# EasyEDA Pro project DOUBLE_CAMERA_SCARY.eprj, schematic Adafruit OV5640 Breakout
Board Name: Adafruit OV5640 Breakout; Create Date: 2025-06-23; Page Name: Adafruit OV5640 Breakout_1; Project Name: DOUBLE_CAMERA_SCARY; Schematic Name: Adafruit OV5640 Breakout; Update Date: 2025-07-21; Company: EasyEDA.com; Page Size: A4; Version: V1.0
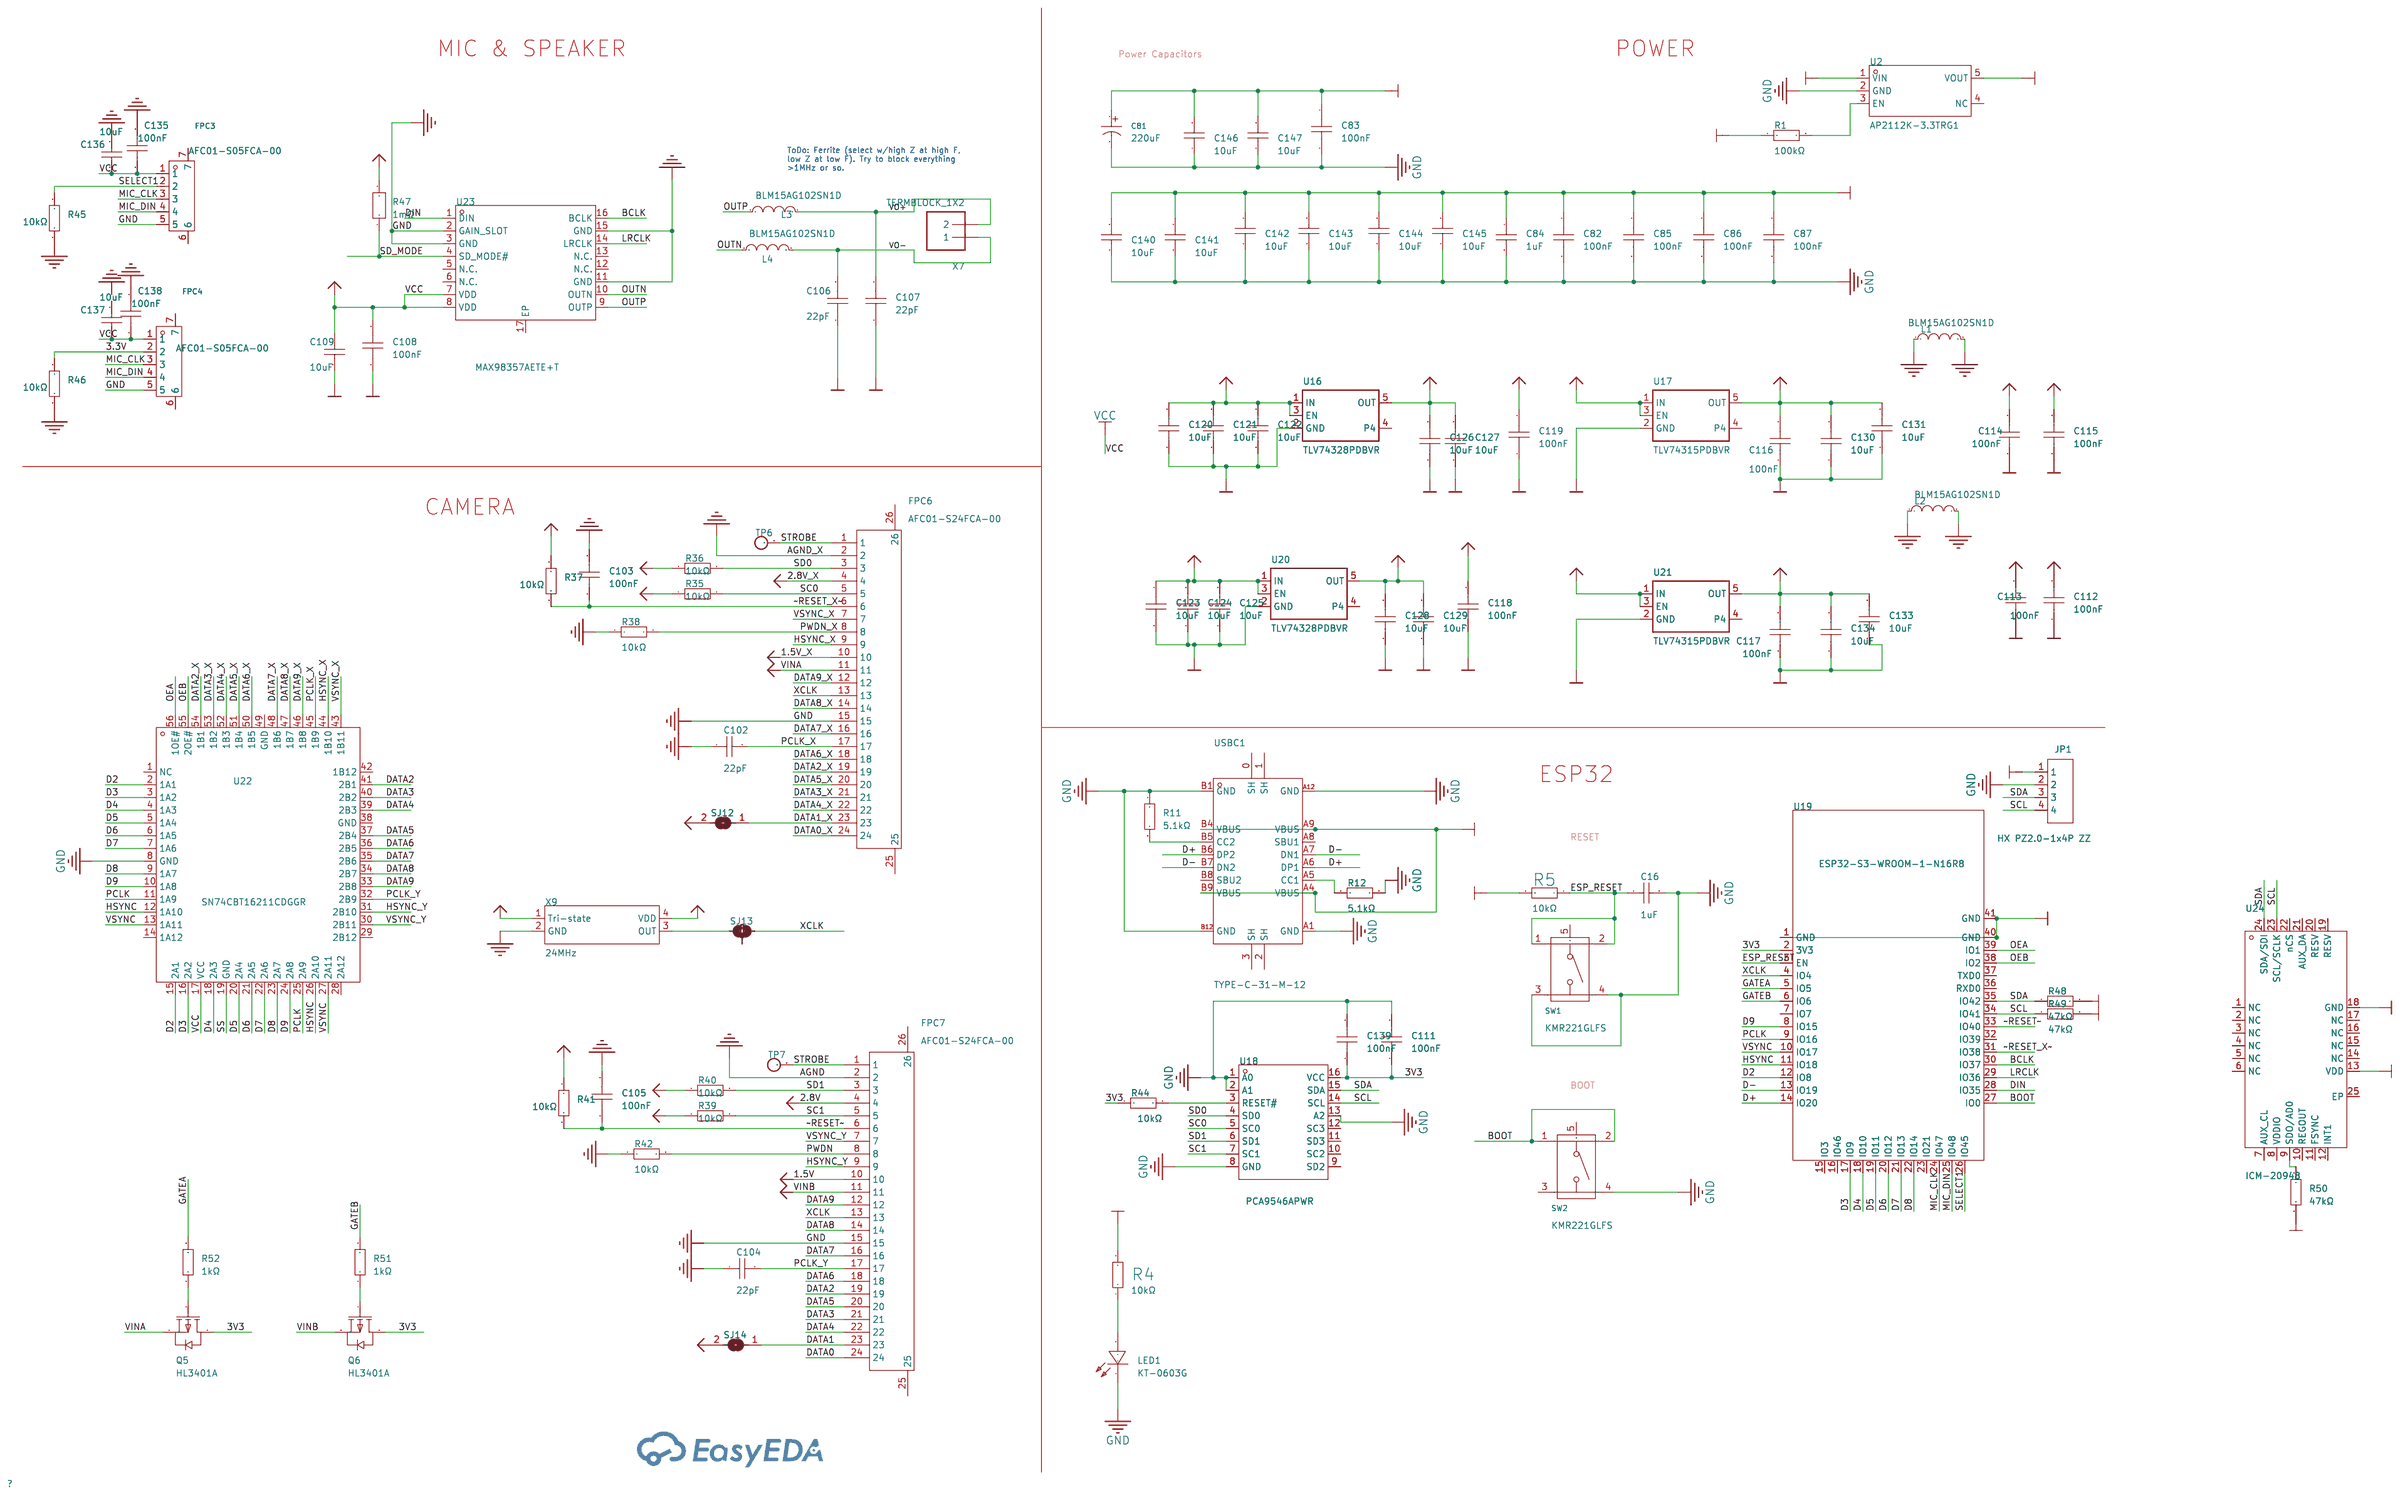
[diagram p0: schematic sheet]

## Parts
C16  1uF  [C0603]
C81  220uF  [CAP-SMD_BD6.3-L6.6-W6.6-LS7.2-FD]
C82  100nF  [C0402]
C83  100nF  [C0402]
C84  1uF  [C0603]
C85  100nF  [C0402]
C86  100nF  [C0402]
C87  100nF  [C0402]
C102  22pF  [C0402]
C103  100nF  [C0402]
C104  22pF  [C0402]
C105  100nF  [C0402]
C106  22pF  [C0402]
C107  22pF  [C0402]
C108  100nF  [C0402]
C109  10uF  [C0402]
C111  100nF  [C0402]
C112  100nF  [C0402]
C113  100nF  [C0402]
C114  100nF  [C0402]
C115  100nF  [C0402]
C116  100nF  [C0402]
C117  100nF  [C0402]
C118  100nF  [C0402]
C119  100nF  [C0402]
C120  10uF  [C0402]
C121  10uF  [C0402]
C122  10uF  [C0402]
C123  10uF  [C0402]
C124  10uF  [C0402]
C125  10uF  [C0402]
C126  10uF  [C0402]
C127  10uF  [C0402]
C128  10uF  [C0402]
C129  10uF  [C0402]
C130  10uF  [C0402]
C131  10uF  [C0402]
C133  10uF  [C0402]
C134  10uF  [C0402]
C135  100nF  [C0402]
C136  10uF  [C0402]
C137  10uF  [C0402]
C138  100nF  [C0402]
C139  100nF  [C0402]
C140  10uF  [C0402]
C141  10uF  [C0402]
C142  10uF  [C0402]
C143  10uF  [C0402]
C144  10uF  [C0402]
C145  10uF  [C0402]
C146  10uF  [C0402]
C147  10uF  [C0402]
FPC3  AFC01-S05FCA-00  [FPC-SMD_AFC01-S05FCA-00]
FPC4  AFC01-S05FCA-00  [FPC-SMD_AFC01-S05FCA-00]
FPC6  AFC01-S24FCA-00  [FPC-SMD_24P-P0.50_AFC01-S24FCA-00]
FPC7  AFC01-S24FCA-00  [FPC-SMD_24P-P0.50_AFC01-S24FCA-00]
JP1  HX PZ2.0-1x4P ZZ  [HDR-TH_4P-P2.00-V-M-3]
L1  BLM15AG102SN1D  [L0402]
L2  BLM15AG102SN1D  [L0402]
L3  BLM15AG102SN1D  [L0402]
L4  BLM15AG102SN1D  [L0402]
LED1  KT-0603G  [LED0603-RD]
Q5  HL3401A  [SOT-23-3_L2.9-W1.3-P1.90-LS2.4-BR]
Q6  HL3401A  [SOT-23-3_L2.9-W1.3-P1.90-LS2.4-BR]
R1  100kΩ  [R0603]
R4  10kΩ  [R0603]
R5  10kΩ  [R0603]
R11  5.1kΩ  [R0603]
R12  5.1kΩ  [R0603]
R35  10kΩ  [R0402]
R36  10kΩ  [R0402]
R37  10kΩ  [R0402]
R38  10kΩ  [R0402]
R39  10kΩ  [R0402]
R40  10kΩ  [R0402]
R41  10kΩ  [R0402]
R42  10kΩ  [R0402]
R44  10kΩ  [R0402]
R45  10kΩ  [R0402]
R46  10kΩ  [R0402]
R47  1mΩ  [R1206]
R48  47kΩ  [R0402]
R49  47kΩ  [R0402]
R50  47kΩ  [R0402]
R51  1kΩ  [R0402]
R52  1kΩ  [R0402]
SJ12  SOLDERJUMPER  [SOLDERJUMPER_ARROW_NOPASTE]
SJ13  SOLDERJUMPER_2WAY  [SOLDERJUMPER_2WAY_OPEN_NOPASTE]
SJ14  SOLDERJUMPER  [SOLDERJUMPER_ARROW_NOPASTE]
SW1  KMR221GLFS  [KEY-SMD_KMR2XXGXXX]
SW2  KMR221GLFS  [KEY-SMD_KMR2XXGXXX]
TP6  TESTPOINTROUND1.5MM  [TESTPOINT_ROUND_1.5MM]
TP7  TESTPOINTROUND1.5MM  [TESTPOINT_ROUND_1.5MM]
U2  AP2112K-3.3TRG1  [SOT-25-5_L2.9-W1.6-P0.95-LS2.8-BL]
U16  TLV74328PDBVR  [SOT-23-5_L3.0-W1.7-P0.95-LS2.8-BL]
U17  TLV74315PDBVR  [SOT-23-5_L2.9-W1.6-P0.95-LS2.8-BL]
U18  PCA9546APWR  [TSSOP-16_L5.0-W4.4-P0.65-LS6.4-BL]
U19  ESP32-S3-WROOM-1-N16R8  [WIRELM-SMD_ESP32-S3-WROOM-1]
U20  TLV74328PDBVR  [SOT-23-5_L3.0-W1.7-P0.95-LS2.8-BL]
U21  TLV74315PDBVR  [SOT-23-5_L2.9-W1.6-P0.95-LS2.8-BL]
U22  SN74CBT16211CDGGR  [TSSOP-56_L14.0-W6.1-P0.50-LS8.1-BL]
U23  MAX98357AETE+T  [TQFN-16_L3.0-W3.0-P0.50-BL-EP1.5]
U24  ICM-20948  [QFN-24_L3.0-W3.0-P0.40-BL-EP]
USBC1  TYPE-C-31-M-12  [USB-C_SMD-TYPE-C-31-M-12]
X7  TERMBLOCK_1X2  [TERMBLOCK_1X2-3.5MM]
X9  24MHz  [OSC-SMD_4P-L3.2-W2.5-BL]

## Library data of the parts
C16 C84 = CL10A105KO8NNNC: Capacitance: Tolerance:±10% Tolerance:±10% Voltage Rated: Temperature Coefficient:; LCSC Part Name: 1uF ±10% 16V; Supplier Part: C1592; Manufacturer: SAMSUNG(三星); Supplier Footprint: 0603; JLCPCB Part Class: Extended Part; Datasheet: https://atta.szlcsc.com/upload/public/pdf/source/20220919/9FBE606BE0D9532D730F292EB26DC5BB.pdf; Supplier: LCSC; Tolerance: ±10%
C81 = RVT0J221M0605: Capacitance: Tolerance:±20% Tolerance:±20% Rated Voltage: Ripple Current:- Equivalent Series Resistance(ESR):- φD: L: Lifetime @ Temp:2000hrs@105℃ Operating Temperature:-55℃~+105℃ Operating Temperature:-55℃~+105℃; LCSC Part Name: 220uF ±20% 6.3V; Supplier Part: C32514; Manufacturer: HONOR(荣誉); Supplier Footprint: SMD,D6.3xL5.4mm; JLCPCB Part Class: Extended Part; Datasheet: https://atta.szlcsc.com/upload/public/pdf/source/20210521/C113284_25C86AE95FB541053FE695F13EA8E7D0.pdf; Supplier: LCSC; Tolerance: ±20%; Lifetime @ Temp: 2000hrs@105℃; Operating Temperature: -55℃~+105℃
C82 C83 C85-C87 = CL05B104KO5NNNC: Capacitance: Tolerance:±10% Tolerance:±10% Voltage Rated: Temperature Coefficient:; LCSC Part Name: 100nF ±10% 16V; Supplier Part: C1525; Manufacturer: SAMSUNG(三星); Supplier Footprint: 0402; JLCPCB Part Class: Basic Part; Datasheet: https://atta.szlcsc.com/upload/public/pdf/source/20160218/1457707763339.pdf; Supplier: LCSC; Tolerance: ±10%
C102 C104 = 0402CG220J500NT: LCSC Part Name: 22pF ±5% 50V; Supplier Part: C1555; Manufacturer: FH(风华); Supplier Footprint: 0402; JLCPCB Part Class: 基础库; Datasheet: https://atta.szlcsc.com/upload/public/pdf/source/20200305/C486355_26A10D38EF8C2A5C37091D0039909270.pdf; Supplier: LCSC; Tolerance: ±5%; Voltage Rated: 50V; Temperature Coefficient: C0G
C103 C105 C108 C111-C119 C135 C138 C139 = CL05B104KB54PNC: LCSC Part Name: 100nF ±10% 50V; Supplier Part: C307331; Manufacturer: SAMSUNG(三星); Supplier Footprint: 0402; JLCPCB Part Class: 基础库; Datasheet: https://atta.szlcsc.com/upload/public/pdf/source/20160218/1457707763339.pdf; Supplier: LCSC; Tolerance: ±10%; Voltage Rated: 50V; Temperature Coefficient: X7R
C106 C107 = CGA0402C0G220J500GT: LCSC Part Name: 22pF ±5% 50V; Supplier Part: C42371856; Manufacturer: HRE(芯声); Supplier Footprint: 0402; JLCPCB Part Class: 扩展库; Datasheet: https://atta.szlcsc.com/upload/public/pdf/source/20241029/0FA3B23816F5927C93C31CDBE8F5BD84.pdf; Supplier: LCSC; Tolerance: ±5%; Voltage Rating: 50V; Temperature Coefficient: C0G
C109 C136 C137 C140-C147 = CL05A106MQ5NUNC: LCSC Part Name: 10uF ±20% 6.3V; Supplier Part: C15525; Manufacturer: SAMSUNG(三星); Supplier Footprint: 0402; JLCPCB Part Class: 基础库; Datasheet: https://atta.szlcsc.com/upload/public/pdf/source/20220823/2B02EE04F8F211D38A52DCB16EB6BEBA.pdf; Supplier: LCSC; Tolerance: ±20%; Voltage Rated: 6.3V; Temperature Coefficient: X5R
C120-C131 C133 C134 = HGC0402R5106M100NTEJ: LCSC Part Name: 10uF ±20% 10V; Supplier Part: C7472949; Manufacturer: Chinocera(华瓷); Supplier Footprint: 0402; JLCPCB Part Class: 扩展库; Datasheet: https://atta.szlcsc.com/upload/public/pdf/source/20240320/FAC3FEC40A78BC5CCCE96C232A94D860.pdf; Supplier: LCSC; Tolerance: ±20%; Voltage Rated: 10V; Temperature Coefficient: X5R
FPC3 FPC4 = AFC01-S05FCA-00: Locking Feature:Clamshell Contact Type:Bottom Contact Number of Contacts:5P Pitch:0.5mm Mounting Type:卧贴 FFC, FCB Thickness:0.3mm FFC, FCB Thickness:0.3mm Height Above Board:2mm; LCSC Part Name: 间距:0.5mm P数:5P 翻盖式 下接; Supplier Part: C262654; Manufacturer: JS(钜硕电子); Supplier Footprint: SMD,P=0.5mm,卧贴; JLCPCB Part Class: Extended Part; Datasheet: https://atta.szlcsc.com/upload/public/pdf/source/20190816/C413942_2A72D1AC756EAE17EEDF756A339D4500.pdf; Supplier: LCSC; Locking Feature: Clamshell; Contact Type: Bottom Contact; Number of Contacts: 5P; Pitch: 0.5mm; Mounting Type: 卧贴; FFC, FCB Thickness: 0.3mm; Height Above Board: 2mm
FPC6 FPC7 = AFC01-S24FCA-00: LCSC Part Name: 间距:0.5mm P数:24P 翻盖式 下接; Supplier Part: C262669; Manufacturer: JS(钜硕电子); Supplier Footprint: SMD,P=0.5mm,卧贴; JLCPCB Part Class: 扩展库; Datasheet: https://atta.szlcsc.com/upload/public/pdf/source/20190816/C413942_2A72D1AC756EAE17EEDF756A339D4500.pdf; Supplier: LCSC; Locking Feature: 翻盖式; Contact Type: 下接; Number of Contacts: 24P; Pitch: 0.5mm; Mounting Type: 卧贴; FFC, FCB Thickness: 0.3mm; Height Above Board: 2mm
JP1 = HX PZ2.0-1x4P ZZ: LCSC Part Name: 1x4P 间距:2mm 方针 直插; Supplier Part: C22438287; Manufacturer: hanxia(韩下); Supplier Footprint: 插件,P=2mm; JLCPCB Part Class: Extended Part; Datasheet: https://atta.szlcsc.com/upload/public/pdf/source/20240522/4041CF8381B23872C6D86DE397775C63.pdf; Supplier: LCSC; Pin Structure: 1x4P; Pitch: 2mm; Circluar Pins/Square Pins: Policy; Mounting Type: Straight; Number of Rows: Single Row; Number of Pins: 4P; Current Rating: 1.5A; Length of Mating Pin: 3.9mm; Insulation Height: 2mm; Length of End Connection Pin: 2.8mm; Contact Material: Phosphor Bronze; Contact Plating: Gold; Operating Temperature: -40℃~+105℃; Color: Black
L1-L4 = BLM15AG102SN1D: LCSC Part Name: 单路 0402磁珠 阻抗1kΩ@100MHz; Supplier Part: C76883; Manufacturer: muRata(村田); Supplier Footprint: 0402; JLCPCB Part Class: 扩展库; Datasheet: https://atta.szlcsc.com/upload/public/pdf/source/20181120/C333978_3E581FB55966932B05020139ABDE8E01.pdf; Supplier: LCSC; Impedance @ Frequency: 1kΩ@100MHz; Tolerance: ±25%; DC Resistance: 650mΩ; Current Rating: 300mA; Circuits: 1
LED1 = KT-0603G: Emitted Color:Emerald; LCSC Part Name: 0603 翠绿 高亮; Supplier Part: C12624; Manufacturer: KENTO; Supplier Footprint: 0603; JLCPCB Part Class: Extended Part; Datasheet: https://atta.szlcsc.com/upload/public/pdf/source/20160120/1457707754255.pdf; Supplier: LCSC; Emitted Color: Emerald
Q5 Q6 = HL3401A: LCSC Part Name: 1个P沟道 耐压:30V 电流:4.2A; Supplier Part: C7420349; Manufacturer: 宏嘉诚; Supplier Footprint: SOT-23; JLCPCB Part Class: 扩展库; Datasheet: https://atta.szlcsc.com/upload/public/pdf/source/20250218/AB44DCFCE1A4DB9A9C9188D881903A3E.pdf; Supplier: LCSC; Type: 1个P沟道; Drain to Source Voltage: 30V; Current - Continuous Drain(Id): 4.2A; RDS(on): 55mΩ@10V,4.2A; Pd - Power Dissipation: 350mW; Gate Threshold Voltage (Vgs(th)@Id): 900mV; Gate Charge(Qg): 22nC@10V; Input Capacitance(Ciss@Vds): 954pF; Reverse Transfer Capacitance (Crss@Vds): 77pF; Operating Temperature: -55℃~+150℃
R1 = 0603WAF1003T5E: Type:Thick Film Resistors Resistance:100kΩ Tolerance:±1% Tolerance:±1% Power(Watts): Overload Voltage (Max): Temperature Coefficient:±100ppm/℃ Temperature Coefficient:±100ppm/℃ Operating Temperature Range:-55℃~+155℃ Operating Temperature Range:-55℃~+155℃; LCSC Part Name: 100kΩ ±1% 100mW 厚膜电阻; Supplier Part: C25803; Manufacturer: UNI-ROYAL(厚声); Supplier Footprint: 0603; Datasheet: https://atta.szlcsc.com/upload/public/pdf/source/20200306/C422600_1E6D84923E4A46A82E41ADD87F860B5C.pdf; Supplier: LCSC; Type: Thick Film Resistors; Tolerance: ±1%; Temperature Coefficient: ±100ppm/℃; Operating Temperature Range: -55℃~+155℃
R4 R5 = 0603WAF1002T5E: Type:Thick Film Resistors Resistance:10kΩ Tolerance:±1% Tolerance:±1% Power(Watts): Overload Voltage (Max): Temperature Coefficient:±100ppm/℃ Temperature Coefficient:±100ppm/℃ Operating Temperature Range:-55℃~+155℃ Operating Temperature Range:-55℃~+155℃; LCSC Part Name: 厚膜电阻 10kΩ ±1% 100mW; Supplier Part: C25804; Manufacturer: UNI-ROYAL(厚声); Supplier Footprint: 0603; Datasheet: https://atta.szlcsc.com/upload/public/pdf/source/20200306/C422600_1E6D84923E4A46A82E41ADD87F860B5C.pdf; Supplier: LCSC; Type: Thick Film Resistors; Tolerance: ±1%; Temperature Coefficient: ±100ppm/℃; Operating Temperature Range: -55℃~+155℃
R11 R12 = 0603WAF5101T5E: Type:Thick Film Resistors Resistance:5.1kΩ Tolerance:±1% Tolerance:±1% Power(Watts): Overload Voltage (Max): Temperature Coefficient:±100ppm/℃ Temperature Coefficient:±100ppm/℃ Operating Temperature Range:-55℃~+155℃ Operating Temperature Range:-55℃~+155℃; LCSC Part Name: 5.1kΩ ±1% 100mW 厚膜电阻; Supplier Part: C23186; Manufacturer: UNI-ROYAL(厚声); Supplier Footprint: 0603; Datasheet: https://atta.szlcsc.com/upload/public/pdf/source/20200306/C422600_1E6D84923E4A46A82E41ADD87F860B5C.pdf; Supplier: LCSC; Type: Thick Film Resistors; Tolerance: ±1%; Temperature Coefficient: ±100ppm/℃; Operating Temperature Range: -55℃~+155℃
R35-R42 R44-R46 = 0402WGF1002TCE: LCSC Part Name: 10kΩ ±1% 62.5mW 厚膜电阻; Supplier Part: C25744; Manufacturer: UNI-ROYAL(厚声); Supplier Footprint: 0402; JLCPCB Part Class: 基础库; Datasheet: https://atta.szlcsc.com/upload/public/pdf/source/20200306/C422600_1E6D84923E4A46A82E41ADD87F860B5C.pdf; Supplier: LCSC; Type: 厚膜电阻; Tolerance: ±1%; Power(Watts): 62.5mW; Overload Voltage (Max): 50V; Temperature Coefficient: ±100ppm/℃; Operating Temperature Range: -55℃~+155℃
R47 = RE1206F1R001: LCSC Part Name: 1mΩ 1W 1206 ±1%; Supplier Part: C46961738; Manufacturer: 捷而瑞; Supplier Footprint: 1206; JLCPCB Part Class: 扩展库; Datasheet: https://atta.szlcsc.com/upload/public/pdf/source/20250325/401775B85EF7B3A580BC34DFED100CB2.pdf; Supplier: LCSC; Type: 采样电阻; Tolerance: ±1%; Power(Watts): 1W; Temperature Coefficient: ±100ppm/℃
R48-R50 = 0402WGF4702TCE: LCSC Part Name: 47kΩ ±1% 62.5mW 厚膜电阻; Supplier Part: C25792; Manufacturer: UNI-ROYAL(厚声); Supplier Footprint: 0402; JLCPCB Part Class: 基础库; Datasheet: https://atta.szlcsc.com/upload/public/pdf/source/20200306/C422600_1E6D84923E4A46A82E41ADD87F860B5C.pdf; Supplier: LCSC; Type: 厚膜电阻; Tolerance: ±1%; Power(Watts): 62.5mW; Overload Voltage (Max): 50V; Temperature Coefficient: ±100ppm/℃; Operating Temperature Range: -55℃~+155℃
R51 R52 = 0402WGF1001TCE: LCSC Part Name: 1kΩ ±1% 62.5mW 厚膜电阻; Supplier Part: C11702; Manufacturer: UNI-ROYAL(厚声); Supplier Footprint: 0402; JLCPCB Part Class: 基础库; Datasheet: https://atta.szlcsc.com/upload/public/pdf/source/20200306/C422600_1E6D84923E4A46A82E41ADD87F860B5C.pdf; Supplier: LCSC; Type: 厚膜电阻; Tolerance: ±1%; Power(Watts): 62.5mW; Overload Voltage (Max): 50V; Temperature Coefficient: ±100ppm/℃; Operating Temperature Range: -55℃~+155℃
SJ12 SJ14 = microbuilder_SOLDERJUMPER_: BOM: EXCLUDE
SJ13 = microbuilder_SOLDERJUMPER_2WAY_
SW1 SW2 = KMR221GLFS: Circuit:SPST Actuator Style:Round Button Operating Force:200gf Mounting Style:Brick nogging Switch Length:4.6mm Switch Width:2.8mm Switch Height:1.9mm Contact Current:50mA Voltage Rating (DC):32V With Lamp:- Pin Style:Gull Wing Mechanical Life:- Operating; LCSC Part Name: 4.6*2.8*1.9mm 立贴 轻触开关; Supplier Part: C72443; Manufacturer: C&K; Supplier Footprint: SMD; JLCPCB Part Class: Extended Part; Datasheet: https://atta.szlcsc.com/upload/public/pdf/source/20181012/C265019_000848423B8E84768868498C37CC451B.pdf; Supplier: LCSC; Circuit: SPST; Actuator Style: Round Button; Operating Force: 200gf; Mounting Style: Brick nogging; Switch Length: 4.6mm; Switch Width: 2.8mm; Switch Height: 1.9mm; Contact Current: 50mA; Voltage Rating (DC): 32V; Pin Style: Gull Wing; Operating Temperature: -40℃~+85℃
TP6 TP7 = microbuilder_TESTPOINT_ROUND1.5MM
U2 = AP2112K-3.3TRG1: Output Type:Fixed Maximum Input Voltage:6V Output Voltage:3.3V Output Voltage:3.3V Output Current:600mA Power Supply Rejection Ratio (PSRR):65dB@(1kHz) Dropout Voltage:400mV@(600mA) standby current:80uA Feature:ESD Protection；Automatic Discharge Function；; LCSC Part Name: 输入6V 输出3.3V 600mA; Supplier Part: C51118; Manufacturer: DIODES(美台); Supplier Footprint: SOT-25-5; JLCPCB Part Class: Extended Part; Datasheet: https://atta.szlcsc.com/upload/public/pdf/source/20171221/C51118_15138312998391195590.pdf; Supplier: LCSC; Output Type: Fixed; Maximum Input Voltage: 6V; Output Voltage: 3.3V; Output Current: 600mA; Power Supply Rejection Ratio (PSRR): 65dB@(1kHz); Dropout Voltage: 400mV@(600mA); standby current: 80uA; Feature: ESD Protection；Automatic Discharge Function；Low ESR；Thermal Protection(TSD)；Overcurrent Protection(OCP)；With ability; Operating Temperature: -40℃~+85℃; Output Polarity: Positive electrode; Number of Outputs: 1
U16 U20 = TLV74328PDBVR: LCSC Part Name: 具有使能功能的 300mA、低 IQ、低压降稳压器; Supplier Part: C408971; Manufacturer: TI(德州仪器); Supplier Footprint: SOT-23-5; JLCPCB Part Class: Extended Part; Datasheet: https://www.ti.com/cn/lit/gpn/tlv743p; Supplier: LCSC; Output Type: Fixed; Maximum Input Voltage: 5.5V; Output Voltage: 2.8V; Output Current: 300mA; Power Supply Rejection Ratio (PSRR): 68dB; Dropout Voltage: 290mV@(300mA); standby current: 60uA; Feature: 防静电保护；低ESR；Thermal Protection(TSD)；欠压闭锁；Overcurrent Protection(OCP)；带使能; Operating Temperature: -40℃~+125℃@(Tj); Output Polarity: Positive electrode; Number of Outputs: 1
U17 U21 = TLV74315PDBVR: LCSC Part Name: 具有使能功能的 300mA、低 IQ、低压降稳压器; Supplier Part: C469895; Manufacturer: TI(德州仪器); Supplier Footprint: SOT-23-5; JLCPCB Part Class: Extended Part; Datasheet: https://www.ti.com/cn/lit/gpn/tlv743p; Supplier: LCSC; Output Type: Fixed; Maximum Input Voltage: 5.5V; Output Voltage: 1.5V; Output Current: 300mA; Dropout Voltage: 400mV@(300mA); standby current: 60uA; Feature: ESD Protection；Short-Circuit  Protection；Low ESR；Thermal Protection(TSD)；Under-voltage Lockout；Overcurrent Protection(OCP)；With ability; Operating Temperature: -40℃~+125℃@(Tj); Output Polarity: Positive electrode; Number of Outputs: 1
U18 = PCA9546APWR: Interface:I2C；SMBus Voltage - Supply:2.3V~5.5V Voltage - Supply:2.3V~5.5V Operating Temperature:-40℃~+85℃ Operating Temperature:-40℃~+85℃; LCSC Part Name: PCA9546A低电压4通道I²C和SMBus开关带复位功能; Supplier Part: C400705; Manufacturer: TI(德州仪器); Supplier Footprint: TSSOP-16; JLCPCB Part Class: Extended Part; Datasheet: https://www.ti.com/cn/lit/gpn/pca9546a; Supplier: LCSC; Interface: I2C；SMBus; Voltage - Supply: 2.3V~5.5V; Operating Temperature: -40℃~+85℃
U19 = ESP32-S3-WROOM-1-N16R8: LCSC Part Name: 通用型Wi-Fi+低功耗蓝牙MCU模组; Supplier Part: C2913202; Manufacturer: ESPRESSIF(乐鑫); Supplier Footprint: SMD,18x25.5mm; JLCPCB Part Class: Extended Part; Datasheet: https://atta.szlcsc.com/upload/public/pdf/source/20241030/6A412B13087E1327DF6279F5735253CA.pdf; Supplier: LCSC
U22 = SN74CBT16211CDGGR: Supplier Part: C2674756; Manufacturer: TI(德州仪器); Supplier Footprint: TSSOP-56-6.1mm; JLCPCB Part Class: Extended Part; Datasheet: https://www.ti.com/cn/lit/gpn/sn74cbt16211c; Supplier: LCSC
U23 = MAX98357AETE+T: LCSC Part Name: 微型、低成本、PCM 类 D 级放大器具有 AB 级性能; Supplier Part: C910544; Manufacturer: ADI(亚德诺)/MAXIM(美信); Supplier Footprint: TQFN-16-EP(3x3); JLCPCB Part Class: 扩展库; Datasheet: https://atta.szlcsc.com/upload/public/pdf/source/20210106/C910544_CB6DE4B2CEE254A72E6BDB40E718D281.pdf; Supplier: LCSC; Voltage - Supply: 2.5V~5.5V; Operating Temperature: -40℃~+85℃
U24 = ICM-20948: Supplier Part: C726001; Manufacturer: TDK InvenSense(应美盛); Supplier Footprint: QFN-24(3x3); JLCPCB Part Class: 扩展库; Datasheet: https://atta.szlcsc.com/upload/public/pdf/source/20210715/C726001_EFE09342631EBC06FA98BEAE6CEEEE9D.pdf; Supplier: LCSC; Sensor Type: 加速度计陀螺仪; Operating Temperature: -40℃~+85℃
USBC1 = TYPE-C-31-M-12: Connector Type:Type-C Standard:- Gender:Female Mounting Style:- Number of Contacts:16P Number of Ports:1 Current Rating - Power (Max):5A Operating Temperature Range:- Operating Temperature Range:-; LCSC Part Name: Type-C 母; Supplier Part: C165948; Manufacturer: 韩国韩荣; Supplier Footprint: SMD; Datasheet: https://atta.szlcsc.com/upload/public/pdf/source/20220525/466408E853115E789EDB0DDC29077C05.pdf; Supplier: LCSC; Connector Type: Type-C; Gender: Female; Number of Contacts: 16P; Number of Ports: 1; Current Rating - Power (Max): 5A
X7 = microbuilder_TERMBLOCK_1X2_
X9 = OT2EL4C4JI-111OLP-24M: LCSC Part Name: YSO110TR 24MHZ 4P 3225 1.8V-3.3V ±10PPM -40~85℃ (±20PPM) CMOS; Supplier Part: C5203548; Manufacturer: YXC(扬兴晶振); Supplier Footprint: SMD3225-4P; JLCPCB Part Class: 扩展库; Datasheet: https://atta.szlcsc.com/upload/public/pdf/source/20240731/596E5F7673E50DA744B7F79F139FB8DF.pdf; Supplier: LCSC; Normal temperature Frequency Tolerance: ±10ppm; Output Type: CMOS; Voltage - Supply: 1.8V~3.3V; Frequency Stability: ±20ppm; Operating Temperature: -40℃~+85℃

## Nets
1.5V: C113.2 C117.2 C133.2 C134.2 FPC7.10 U21.5(OUT)
1.5V_X: C114.2 C116.2 C130.2 C131.2 FPC6.10 U17.5(OUT)
2.8V: C112.2 C128.2 C129.2 FPC7.4 U20.5(OUT)
2.8V_X: C115.2 C126.2 C127.2 FPC6.4 U16.5(OUT)
3.3V: FPC4.2 R46.1
3V3: C82.1 C84.1 C85.1 C86.1 C87.1 C111.1 C118.2 C119.2 C139.1 C140.2 C141.2 C142.2 C143.2 C144.2 C145.2 Q5.3(D) Q6.3(D) R4.2 R5.2 R44.1 R48.2 R49.2 R50.2 SJ12.2 SJ14.2 U2.5(VOUT) U18.16(VCC) U19.2(3V3) U24.13(VDD) X9.1(Tri-state) X9.4(VDD)
AGND: FPC7.2 L2.2
AGND_X: FPC6.2 L1.2
GND: C16.2 C81.2 C82.2 C83.2 C84.2 C85.2 C86.2 C87.2 C102.1 C103.2 C104.1 C105.2 C106.1 C107.1 C108.1 C109.1 C111.2 C112.1 C113.1 C114.1 C115.1 C116.1 C117.1 C118.1 C119.1 C120.1 C121.1 C122.1 C123.2 C124.1 C125.1 C126.1 C127.1 C128.1 C129.1 C130.1 C131.1 C133.1 C134.1 C135.2 C136.2 C138.2 C139.2 C140.1 C141.1 C142.1 C143.1 C144.1 C145.1 C146.1 C147.1 FPC3.5 FPC4.5 FPC6.15 FPC7.15 JP1.2 L1.1 L2.1 LED1.1(K) R11.1 R12.2 R38.1 R42.1 R45.2 R46.2 SW1.3 SW1.4 SW2.4 U2.2(GND) U16.2(GND) U17.2(GND) U18.1(A0) U18.2(A1) U18.8(GND) U18.13(A2) U19.1(GND) U19.40(GND) U19.41(GND) U20.2(GND) U21.2(GND) U22.8(GND) U23.2(GAIN_SLOT) U23.3(GND) U23.11(GND) U23.15(GND) U24.18(GND) USBC1.A1(GND) USBC1.A12(GND) USBC1.B1(GND) USBC1.B12(GND) X9.2(GND)
VCC: C81.1 C83.1 C108.2 C109.2 C135.1 C136.1 C137.1 C138.1 C146.2 C147.2 FPC3.1 FPC4.1 JP1.1 R1.1 R47.2 U2.1(VIN) U22.17(VCC) U23.7(VDD) U23.8(VDD) USBC1.A4(VBUS) USBC1.A9(VBUS) USBC1.B4(VBUS) USBC1.B9(VBUS)
VINA: C120.2 C121.2 C122.2 FPC6.11 Q5.2(S) R35.1 R36.1 R37.1 U16.1(IN) U16.3(EN) U17.1(IN) U17.3(EN)
VINB: C123.1 C124.2 C125.2 FPC7.11 Q6.2(S) R39.1 R40.1 R41.1 U20.1(IN) U20.3(EN) U21.1(IN) U21.3(EN)
BCLK: U19.30(IO37) U23.16(BCLK)
BOOT: SW2.1 SW2.2 U19.27(IO0)
D2: U19.12(IO8) U22.2(1A1) U22.15(2A1)
D3: U19.17(IO9) U22.3(1A2) U22.16(2A2)
D4: U19.18(IO10) U22.4(1A3) U22.18(2A3)
D5: U19.19(IO11) U22.5(1A4) U22.20(2A4)
D6: U19.20(IO12) U22.6(1A5) U22.21(2A5)
D7: U19.21(IO13) U22.7(1A6) U22.22(2A6)
D8: U19.22(IO14) U22.9(1A7) U22.23(2A7)
D9: U19.8(IO15) U22.10(1A8) U22.24(2A8)
D+: U19.14(IO20) USBC1.A6(DP1) USBC1.B6(DP2)
D-: U19.13(IO19) USBC1.A7(DN1) USBC1.B7(DN2)
DATA0: FPC7.24
DATA0_X: FPC6.24
DATA1: FPC7.23 SJ14.1
DATA1_X: FPC6.23 SJ12.1
DATA2: FPC7.19 U22.41(2B1)
DATA2_X: FPC6.19 U22.54(1B1)
DATA3: FPC7.21 U22.40(2B2)
DATA3_X: FPC6.21 U22.53(1B2)
DATA4: FPC7.22 U22.39(2B3)
DATA4_X: FPC6.22 U22.52(1B3)
DATA5: FPC7.20 U22.37(2B4)
DATA5_X: FPC6.20 U22.51(1B4)
DATA6: FPC7.18 U22.36(2B5)
DATA6_X: FPC6.18 U22.50(1B5)
DATA7: FPC7.16 U22.35(2B6)
DATA7_X: FPC6.16 U22.48(1B6)
DATA8: FPC7.14 U22.34(2B7)
DATA8_X: FPC6.14 U22.47(1B7)
DATA9: FPC7.12 U22.33(2B8)
DATA9_X: FPC6.12 U22.46(1B8)
DIN: U19.28(IO35) U23.1(DIN)
ESP_RESET: C16.1 R5.1 SW1.1 SW1.2 U19.3(EN)
GATEA: R52.2 U19.5(IO5)
GATEB: R51.2 U19.6(IO6)
HSYNC: U19.11(IO18) U22.12(1A10) U22.26(2A10)
HSYNC_X: FPC6.9 U22.44(1B10)
HSYNC_Y: FPC7.9 U22.31(2B10)
LRCLK: U19.29(IO36) U23.14(LRCLK)
MIC_CLK: FPC3.3 FPC4.3 U19.24(IO47)
MIC_DIN: FPC3.4 FPC4.4 U19.25(IO48)
OEA: U19.39(IO1) U22.56(1OE#)
OEB: U19.38(IO2) U22.55(2OE#)
OUTN: L4.1 U23.10(OUTN)
OUTP: L3.1 U23.9(OUTP)
PCLK: U19.9(IO16) U22.11(1A9) U22.25(2A9)
PCLK_X: C102.2 FPC6.17 U22.45(1B9)
PCLK_Y: C104.2 FPC7.17 U22.32(2B9)
PWDN: FPC7.8 R42.2
PWDN_X: FPC6.8 R38.2
SC0: FPC6.5 R35.2 U18.5(SC0)
SC1: FPC7.5 R39.2 U18.7(SC1)
SCL: JP1.4 R49.1 U18.14(SCL) U19.34(IO41) U24.23(SCL/SCLK)
SD0: FPC6.3 R36.2 U18.4(SD0)
SD1: FPC7.3 R40.2 U18.6(SD1)
SD_MODE: R47.1 U23.4(SD_MODE#)
SDA: JP1.3 R48.1 U18.15(SDA) U19.35(IO42) U24.24(SDA/SDI)
SELECT1: FPC3.2 R45.1 U19.26(IO45)
SS: U22.19(GND)
STROBE: FPC6.1 FPC7.1 TP6.P$1 TP7.P$1
VO+: C107.2 L3.2 X7.2
VO-: C106.2 L4.2 X7.1
VSYNC: U19.10(IO17) U22.13(1A11) U22.27(2A11)
VSYNC_X: FPC6.7 U22.43(1B11)
VSYNC_Y: FPC7.7 U22.30(2B11)
XCLK: FPC6.13 FPC7.13 SJ13.1 U19.4(IO4)
~RESET_X~: C103.1 FPC6.6 R37.2 U19.31(IO38)
~RESET~: C105.1 FPC7.6 R41.2 U19.33(IO40)
$2N4102: R44.2 U18.3(RESET#)
$2N4133: Q5.1(G) R52.1
$2N4138: Q6.1(G) R51.1
$2N9597: SJ13.3 X9.3(OUT)
$2N23062: R1.2 U2.3(EN)
$2N26134: R12.1 USBC1.A5(CC1)
$2N26142: R11.2 USBC1.B5(CC2)
$2N28904: LED1.2(A) R4.1
$2N44705: R50.1 U24.9(SDO/AD0)

Not connected (* = marked no-connect by the designer): C137 2; FPC3 6 7; FPC4 6 7; FPC6 25 26; FPC7 25 26; SJ13 2; SW1 5; SW2 3 5; U2 4(NC); U16 4(P4); U17 4(P4); U18 9(SD2) 10(SC2) 11(SD3) 12(SC3); U19 7(IO7) 15(IO3) 16(IO46) 23(IO21) 32(IO39) 36(RXD0) 37(TXD0); U20 4(P4); U21 4(P4); U22 1(NC) 14(1A12) 28(2A12) 29(2B12) 38(GND) 42(1B12) 49(GND); U23 5(N.C.) 6(N.C.) 12(N.C.) 13(N.C.) 17(EP); U24 1(NC) 2(NC) 3(NC) 4(NC) 5(NC) 6(NC) 7(AUX_CL) 8(VDDIO) 10(REGOUT) 11(FSYNC) 12(INT1) 14(NC) 15(NC) 16(NC) 17(NC) 19(RESV) 20(RESV) 21(AUX_DA) 22(nCS) 25(EP); USBC1 0(SH) 1(SH) 2(SH) 3(SH) A8(SBU1) B8(SBU2)

## Notes on the sheet
- MIC & SPEAKER
- Power Capacitors
- POWER
- ToDo: Ferrite (select w/high Z at high F,
  low Z at low F). Try to block everything
  >1MHz or so.
- CAMERA
- ESP32
- RESET
- BOOT
